# EasyEDA schematic Task 10.1DHD.json

## Sheets
1 Uno-SM Sensor: TITLE: Main PCB; REV: 1.0; Date: 2022-05-17; Sheet: 1/1; Company: Your Company
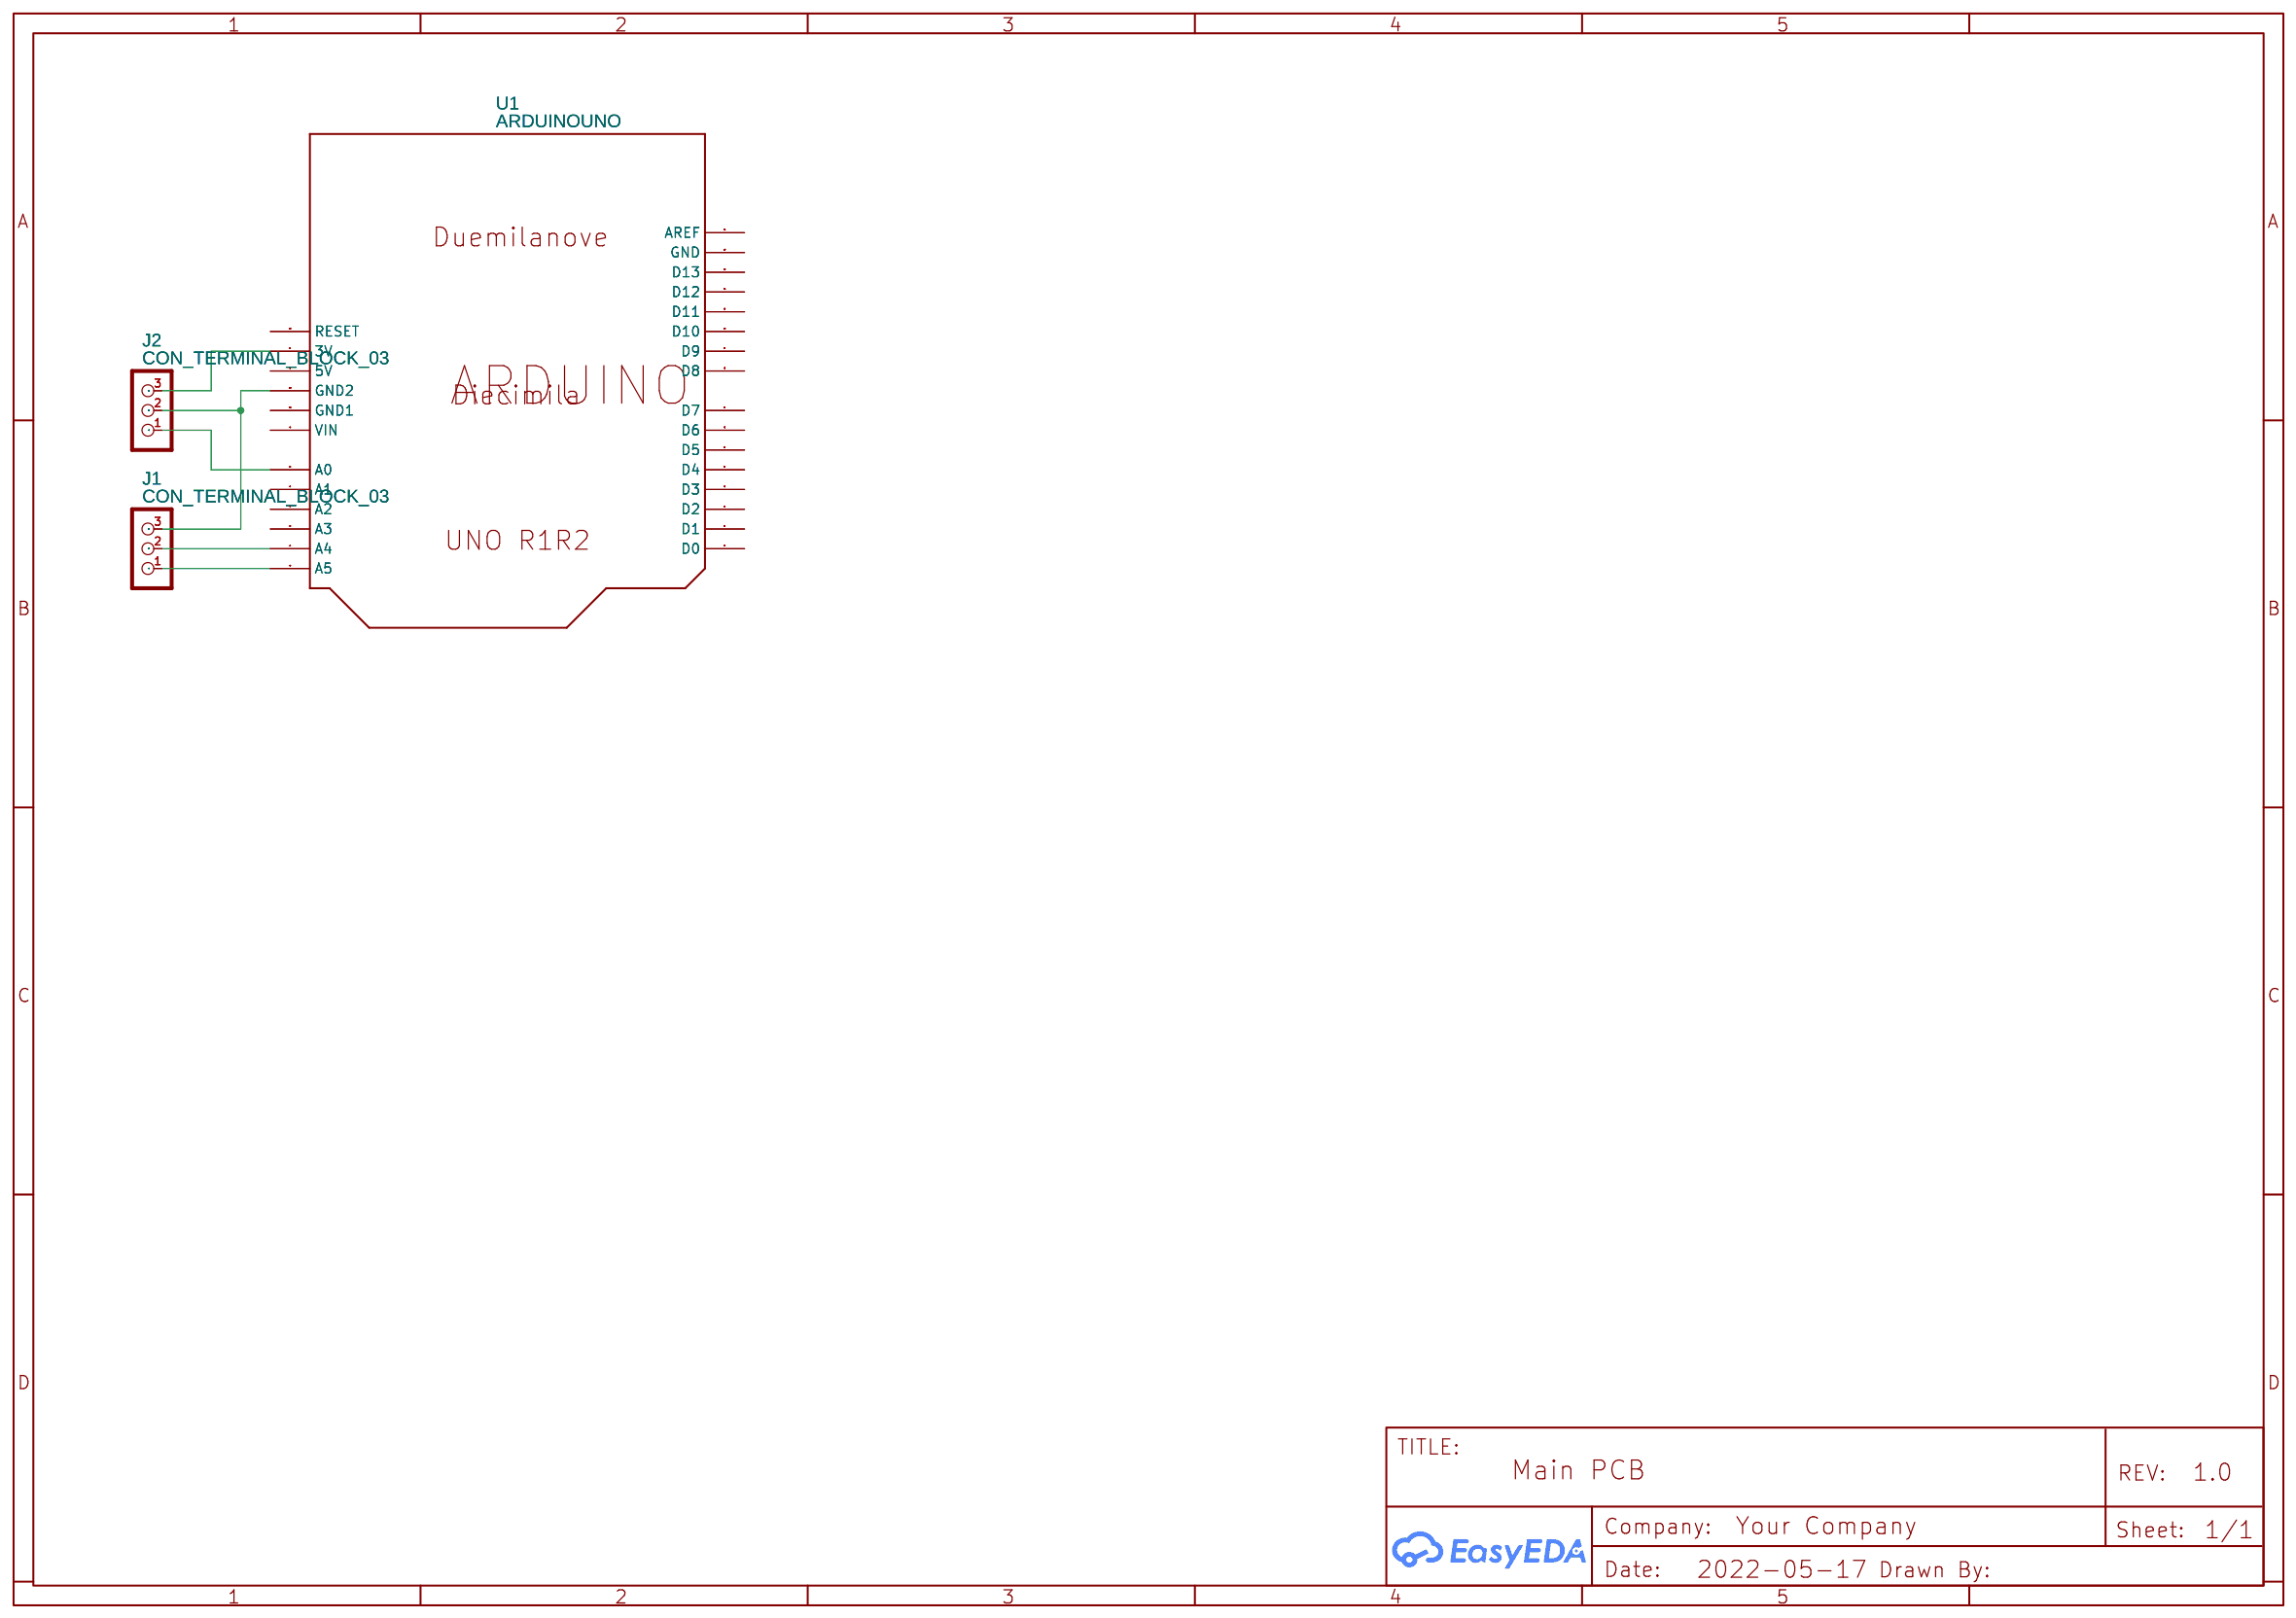
[diagram p0: Uno-SM Sensor]
2 Uno-Pump: TITLE: Sheet_1; Drawn By: cjbock
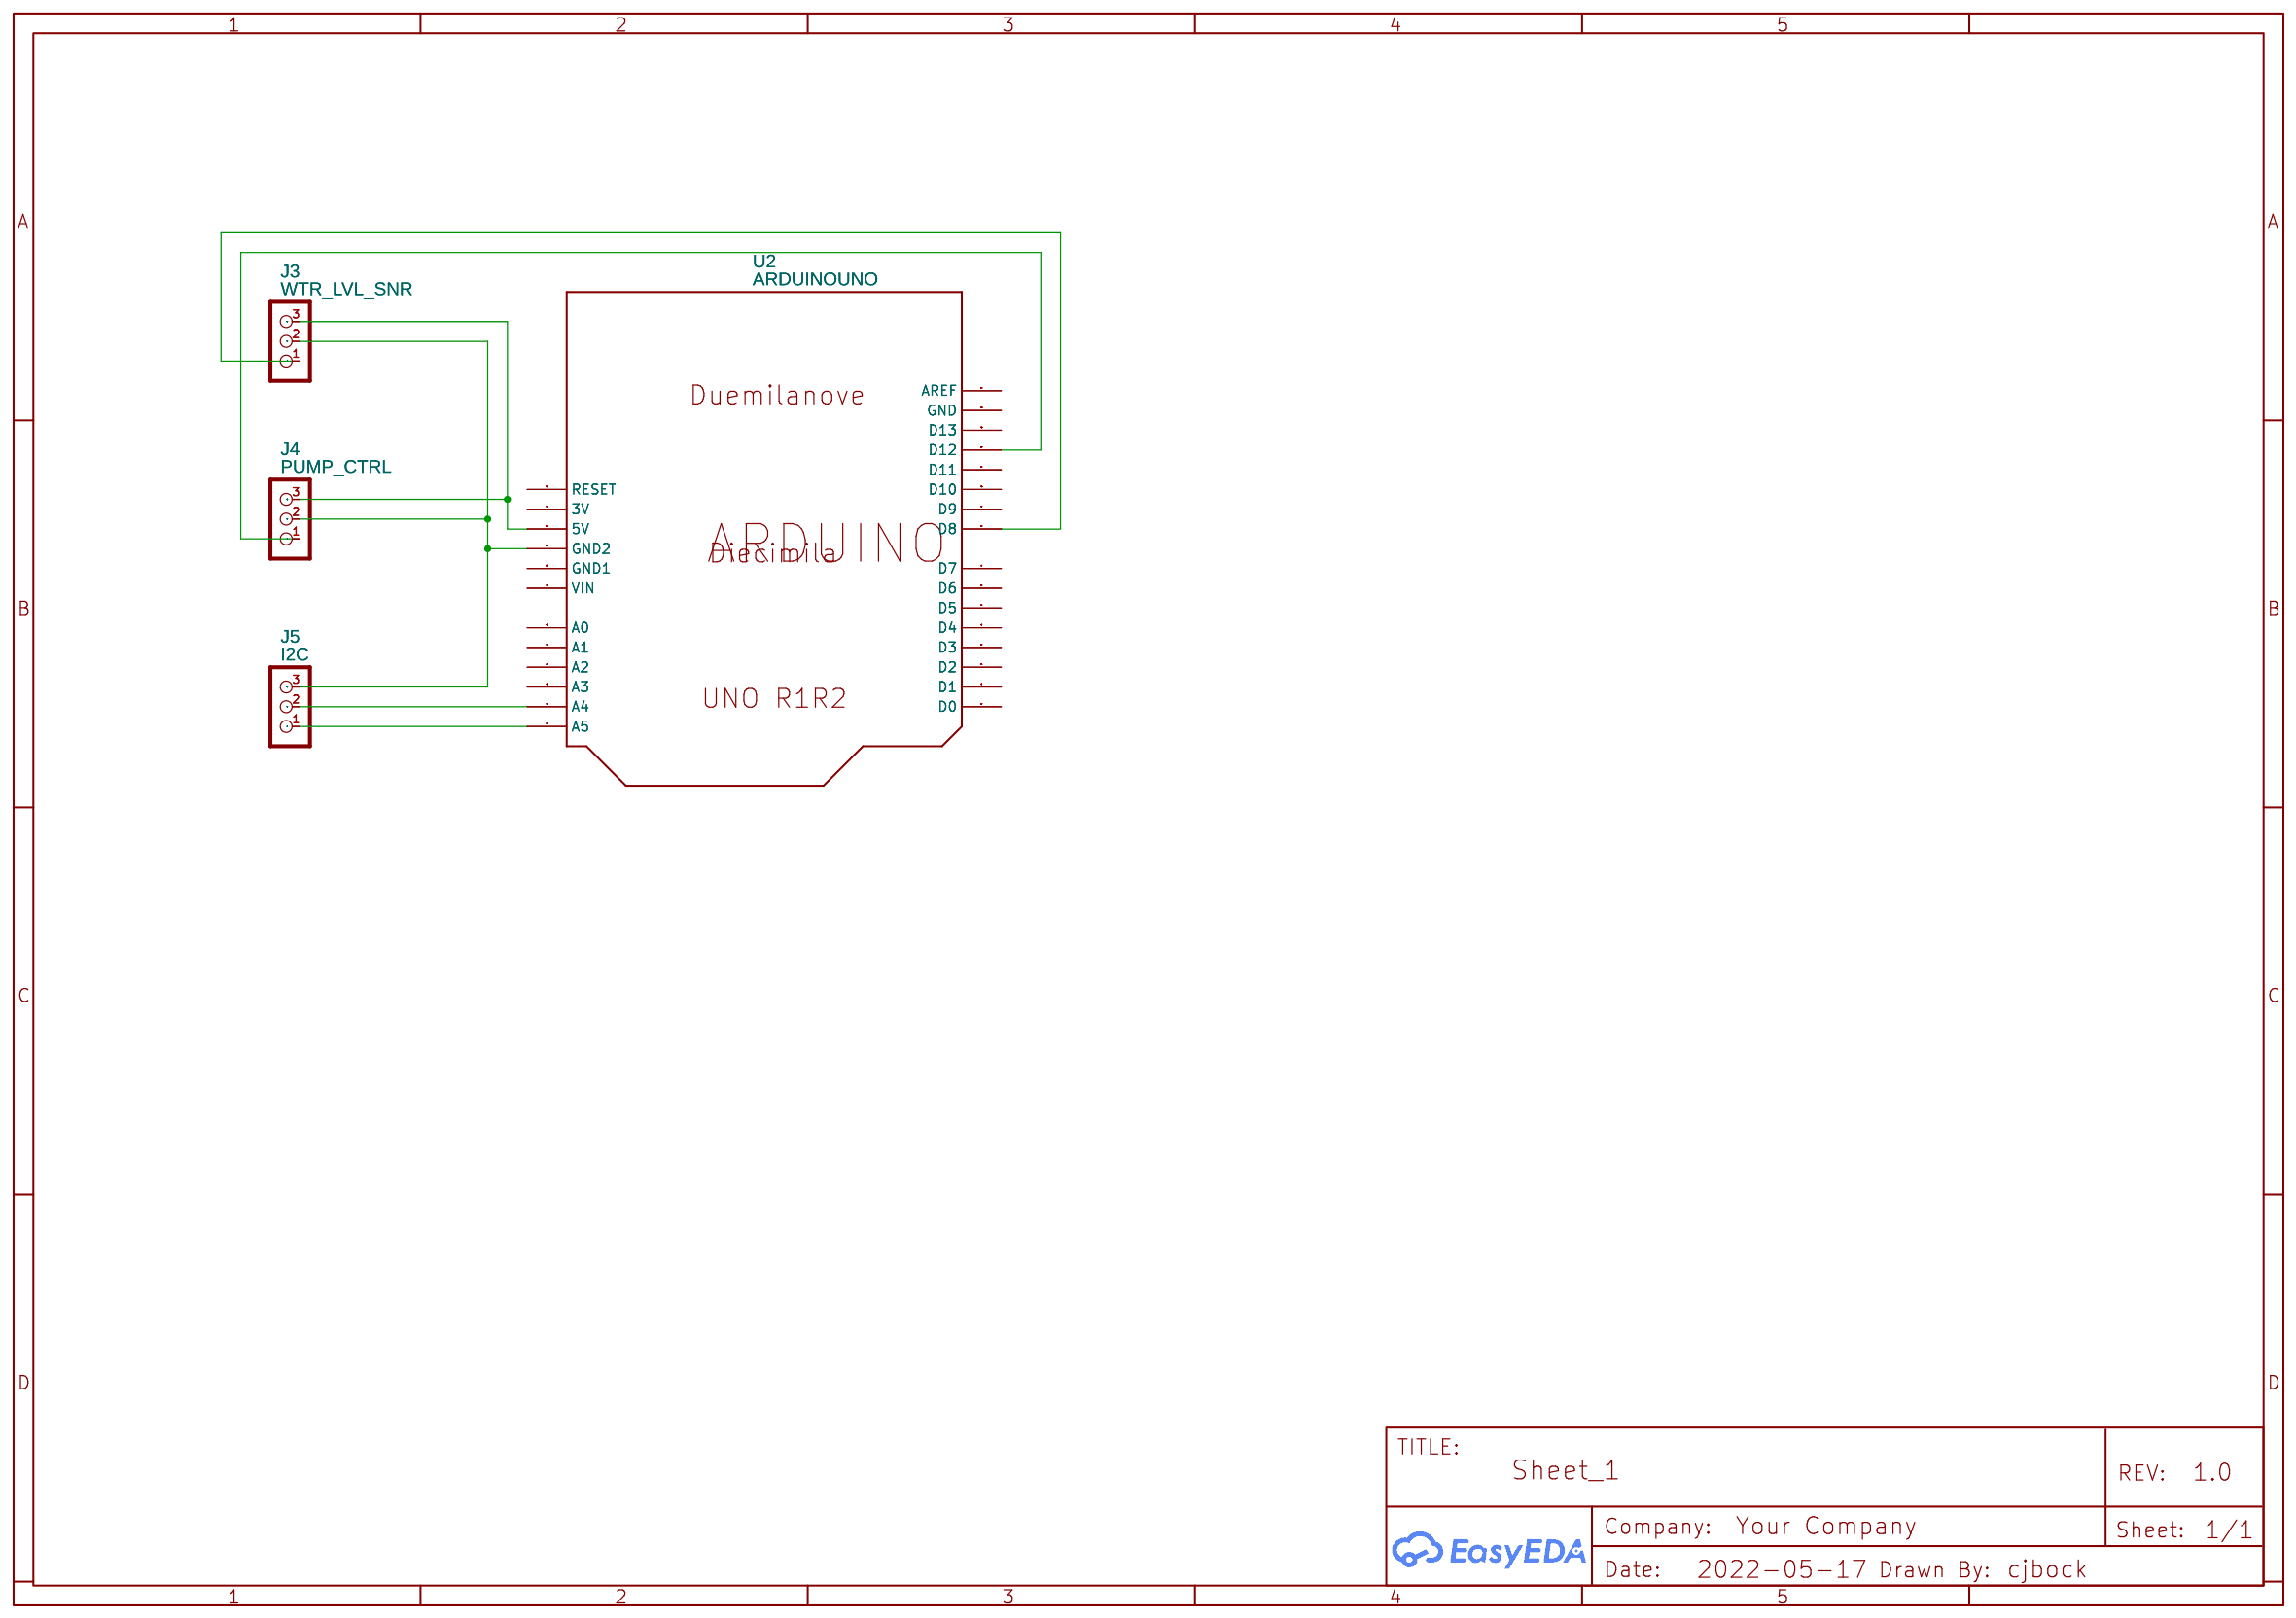
[diagram p1: Uno-Pump]
3 RPI-Board: TITLE: RPi; Drawn By: cjbock
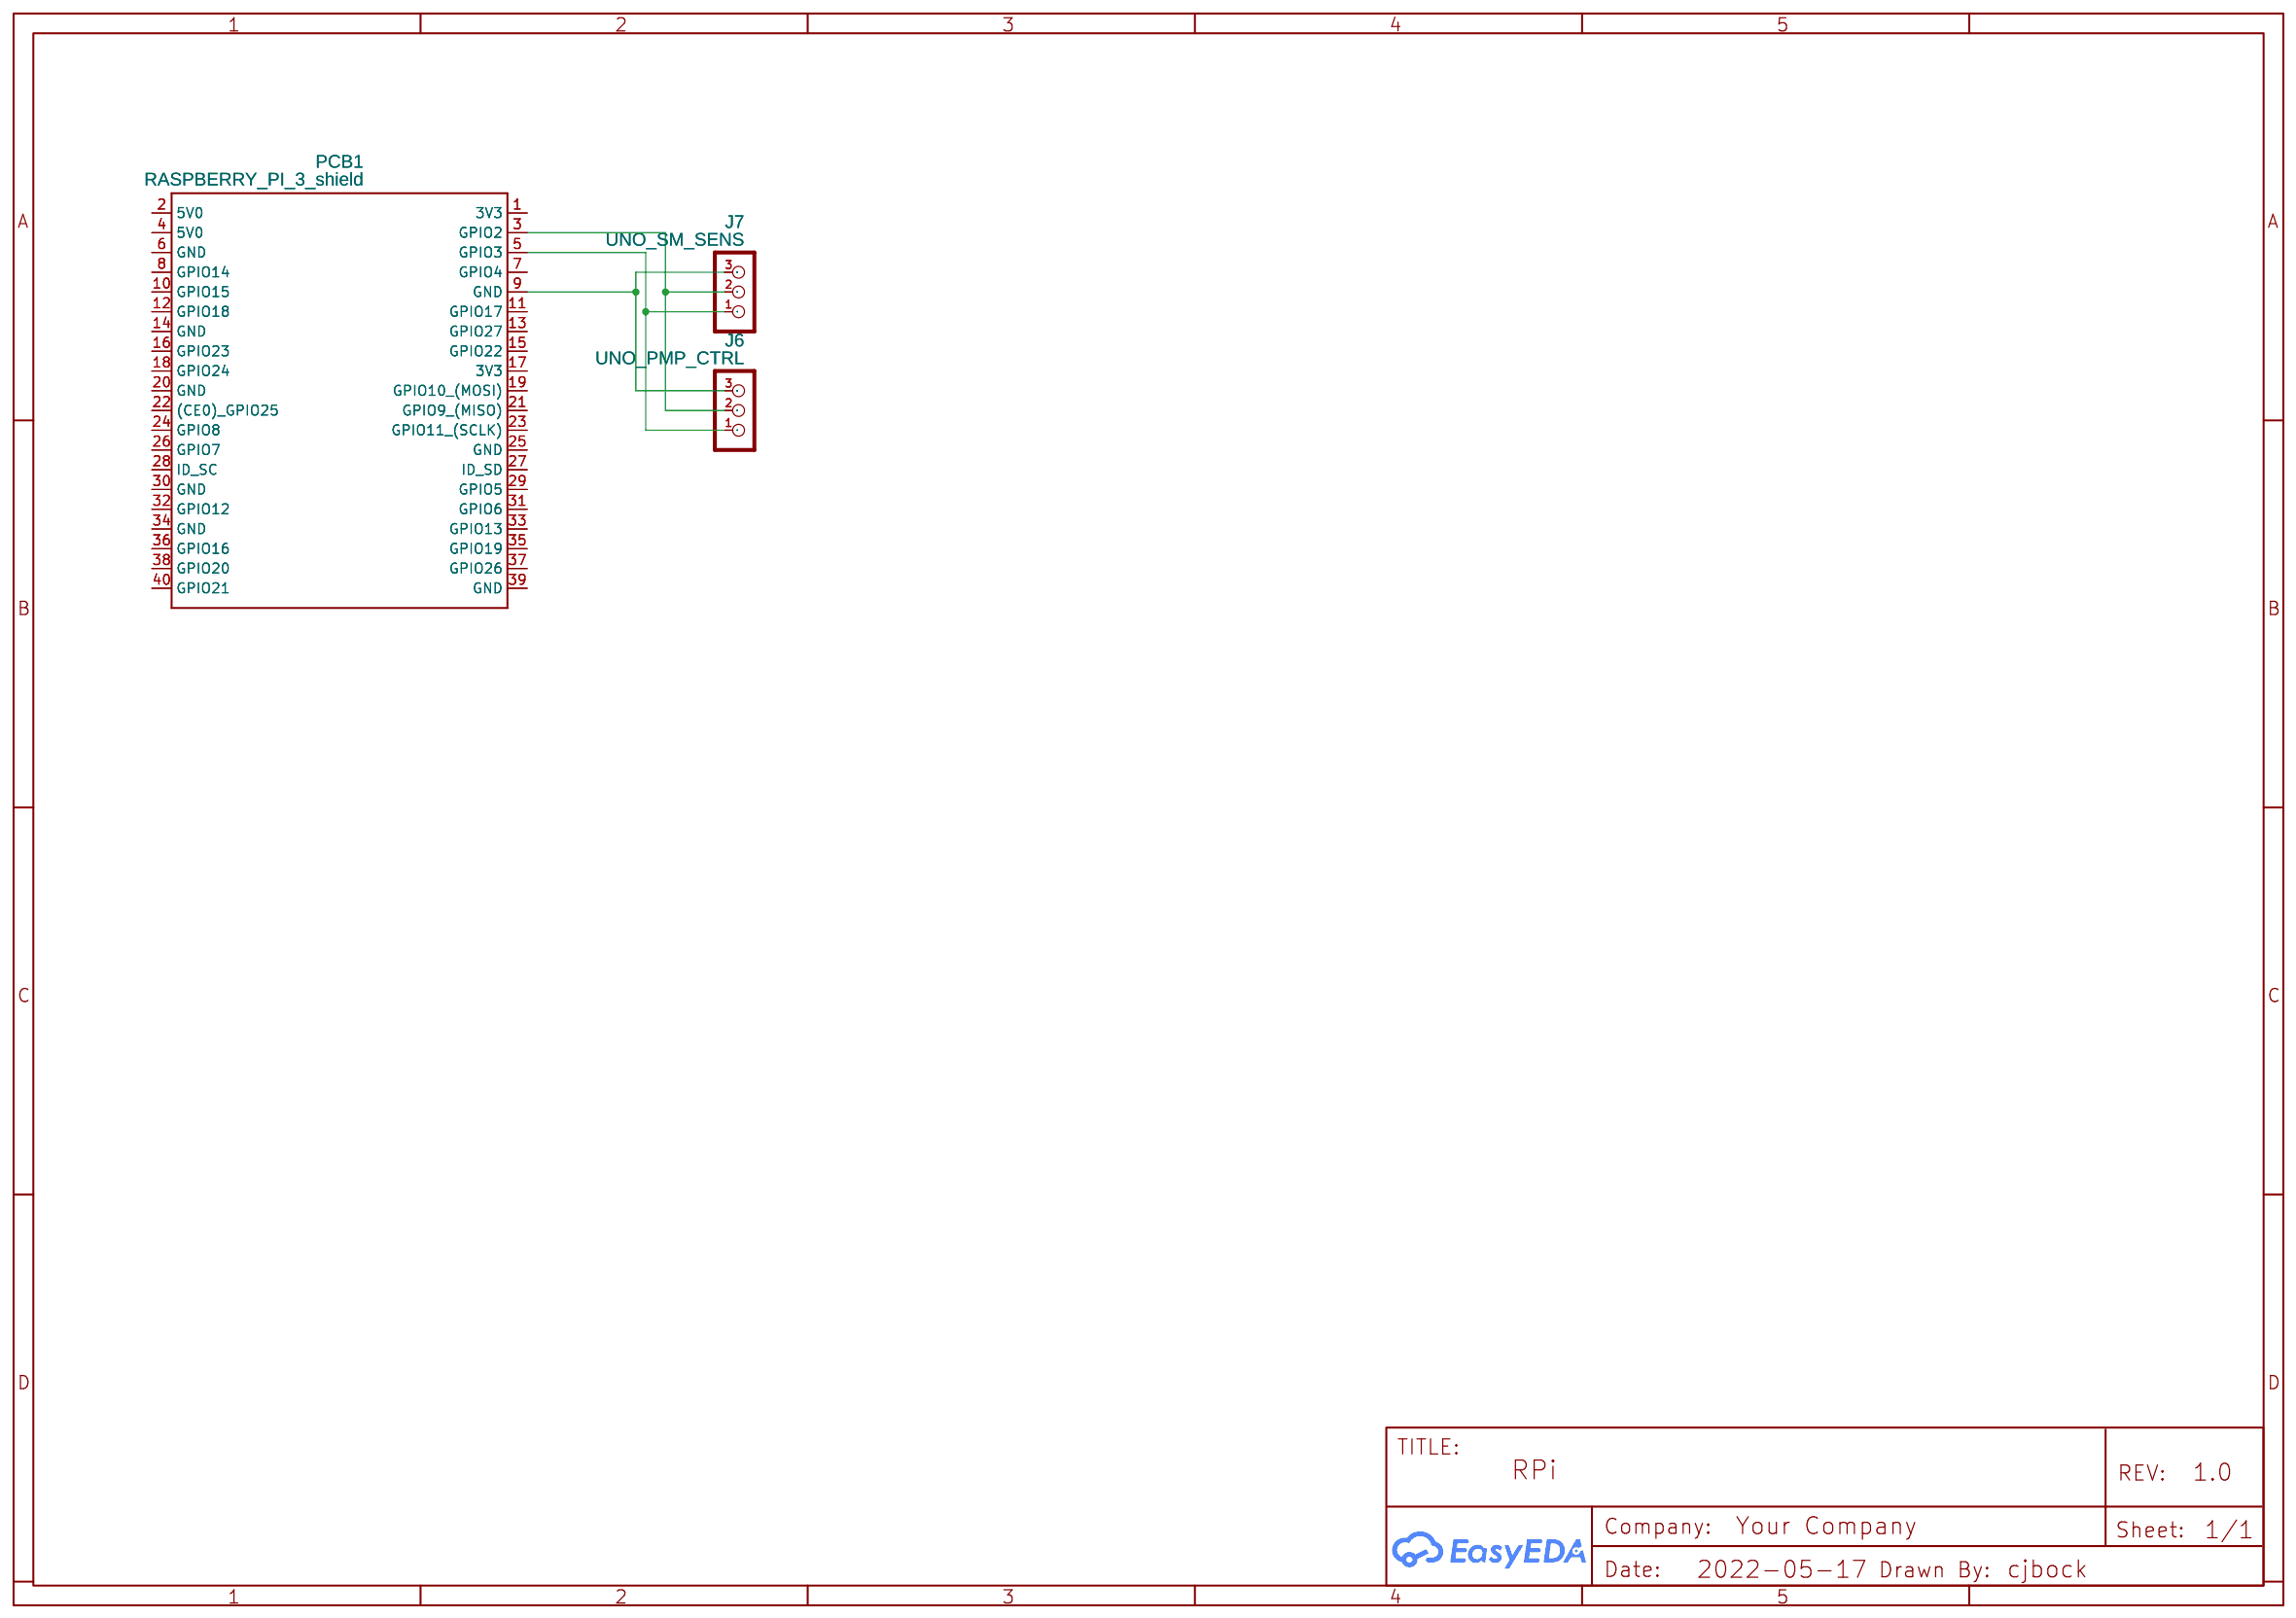
[diagram p2: RPI-Board]

## Parts
sheet RPI-Board
J6  UNO_PMP_CTRL  [TERMINAL_BLOCK_3P_5]
J7  UNO_SM_SENS  [TERMINAL_BLOCK_3P_5]
PCB1  RASPBERRY_PI_3_shield  [RASPBERRY PI MODEL 3 SHIELD]
sheet Uno-Pump
J3  WTR_LVL_SNR  [TERMINAL_BLOCK_3P_5]
J4  PUMP_CTRL  [TERMINAL_BLOCK_3P_5]
J5  I2C  [TERMINAL_BLOCK_3P_5]
U2  ARDUINOUNO  [ARDUINO]
sheet Uno-SM Sensor
J1  CON_TERMINAL_BLOCK_03  [TERMINAL_BLOCK_3P_5]
J2  CON_TERMINAL_BLOCK_03  [TERMINAL_BLOCK_3P_5]
U1  ARDUINOUNO  [ARDUINO]

## Library data of the parts
J3-J7 = CON_TERMINAL_BLOCK_03-5MM: 3 poles, wire to board connector; Contributor: DangerousPrototype
PCB1 = RASPBERRY_PI_3_shield: Raspberry Pi B+; sourceId: a8qICUO6o; Contributor: merge
U1 U2 = ARDUINOUNO: Arduino DiecimilaDuemilanove; Contributor: Adafruit
J1 J2 = CON_TERMINAL_BLOCK_03: Contributor: DangerousPrototype

## Nets
Net-(J1-1): J1.1 U1.A5
Net-(J1-2): J1.2 U1.A4
Net-(J1-3): J1.3 J2.2 U1.GND2
Net-(J2-1): J2.1 U1.A0
Net-(J2-3): J2.3 U1.3V
Net-(J3-1): J3.1 U2.D8
Net-(J3-2): J3.2 J4.2 J5.3 U2.GND2
Net-(J3-3): J3.3 J4.3 U2.5V
Net-(J4-1): J4.1 U2.D12
Net-(J5-1): J5.1 U2.A5
Net-(J5-2): J5.2 U2.A4
Net-(J6-1): J6.1 J7.1 PCB1.5(GPIO3)
Net-(J6-2): J6.2 J7.2 PCB1.3(GPIO2)
Net-(J6-3): J6.3 J7.3 PCB1.9(GND)

Not connected (* = marked no-connect by the designer): PCB1 1(3V3) 2(5V0) 4(5V0) 6(GND) 7(GPIO4) 8(GPIO14) 10(GPIO15) 11(GPIO17) 12(GPIO18) 13(GPIO27) 14(GND) 15(GPIO22) 16(GPIO23) 17(3V3) 18(GPIO24) 19(GPIO10 (MOSI)) 20(GND) 21(GPIO9 (MISO)) 22((CE0) GPIO25) 23(GPIO11 (SCLK)) 24(GPIO8) 25(GND) 26(GPIO7) 27(ID_SD) 28(ID_SC) 29(GPIO5) 30(GND) 31(GPIO6) 32(GPIO12) 33(GPIO13) 34(GND) 35(GPIO19) 36(GPIO16) 37(GPIO26) 38(GPIO20) 39(GND) 40(GPIO21); U1 5V A1 A2 A3 AREF D0 D1 D2 D3 D4 D5 D6 D7 D8 D9 D10 D11 D12 D13 GND GND1 RESET VIN; U2 3V A0 A1 A2 A3 AREF D0 D1 D2 D3 D4 D5 D6 D7 D9 D10 D11 D13 GND GND1 RESET VIN
